# Altium schematic sheet Sheet1.SchDoc
size A
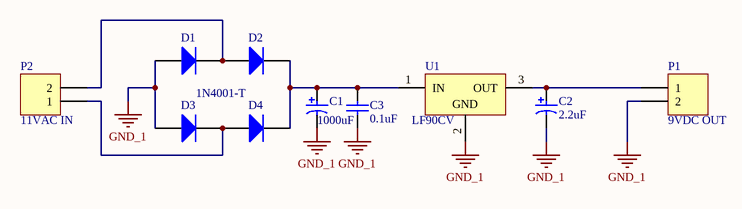
[diagram p0: Sheet1.SchDoc]

## Parts
C1  1000uF  [PNSC-EEUFM1H221-2]
C2  2.2uF  [CAPPR55-200-1100X500X1200]
C3  0.1uF  [VISH-K104K15X7RF5TL2]
D1  1N4001-T  [DIOD-DO-41-P-2_V]  (value not drawn)
D2  1N4001-T  [DIOD-DO-41-P-2_V]  (value not drawn)
D3  1N4001-T  [DIOD-DO-41-P-2_V]  (value not drawn)
D4  1N4001-T  [DIOD-DO-41-P-2_V]
P1  9VDC OUT  [MHDR1X2]
P2  11VAC IN  [MHDR1X2]
U1  LF90CV  [TO220]

## Nets
GND_1: C1.2 C2.2 C3.1 D1.1(A) D3.1(A) P1.2 U1.2(GND)
NetC1_1: C1.1 C3.2 D2.2(K) D4.2(K) U1.1(IN)
NetC2_1: C2.1 P1.1 U1.3(OUT)
NetD1_2: D1.2(K) D2.1(A) P2.2
NetD3_2: D3.2(K) D4.1(A) P2.1

## Library data of the parts
C1 = CMP-2000-05313-1: Aluminum Electrolytic Capacitor, 1000 uF, +/- 20%, 16 V, -40 to 105 degC, 2-Pin THD, RoHS, Tape and Reel; Manufacturer: Panasonic; Capacitance: 1000µF; Ripple Current: 1790mA; Rated Voltage: 16V; Impedance: 0.028O; Type: Radial; Lifetime@Temperature: 8000Hrs@105degC; Operating Temp-Max: 105degC; Operating Temp Range: -40to+105degC; Manufacturer URL: http://www.panasonic.com/; Datasheet URL: http://www.produktinfo.conrad.com/datenblaetter/425000-449999/446746-da-01-en-ALU_KONDENSATOR_FR_R_1000_UF_16V.pdf; Case Size/Dimension: Ø10x16mm; Datasheet Version: Nov-11; Series: FR
C2 = CMP-1665-00040-1: Aluminum Electrolytic Capacitor, 2.2 uF, +/- 20%, 50 V, -40 to 85 degC, 2-Pin THD, RoHS, Bulk; Min Supply Voltage: 1.71 V; Interface: I2C; Case\Package: QFN; Max Supply Voltage: 3.6 V; Load Capacitance: 400 pF; Nominal Supply Voltage: 2.5 V; RoHSCompliant: true; Length: 3 mm; Max Operating Temperature: 85 degC; ComponentLink2URL: http://industrial.panasonic.com/cdbs/www-data/pdf/RDF0000/DMF0000COL68.pdf; ComponentLink1Description: Manufacturer URL; Weight: 0.000617 oz; DatasheetVersion: Mar-16; Width: 3 mm; Packaging: Cut Tape; PackageDescription: 2-Pin Radial Lead, Dia 5 mm, Body Length 11 mm; REACH SVHC: No SVHC; Mount: Surface Mount; Min Operating Temperature: -40 degC; ComponentLink1URL: http://www.panasonic.com/; Height: 0.65 mm; PackageReference: CAPPR55-200-1100X500X1200; ComponentLink2Description: Datasheet; Radiation Hardening: No; Pins: 20; Package Quantity: 1
C3 = CMP-2000-06508-1: Ceramic Capacitor, 100 nF, +/- 10%, 50 V, -55 to 125 degC, 2-Pin THD, RoHS, Tape and Reel; Manufacturer: Vishay; Other Names: BC1084CT; Catalog Drawings: Mono-KapSide2-15_5.58Mono-KapSide1_15; Temperature Coefficient: X7R; Voltage - Rated: 50V; Online Catalog: Mono-Kap™Series; Capacitance: 0.1µF; Size / Dimension: 0.157"Lx0.098"W(4.00mmx2.50mm); Operating Temperature: -55°C~125°C; Family: CeramicCapacitors; Manufacturer URL: http://www.vishay.com/; Standard Package: 1; Thickness (Max): -; Ratings: -; Datasheet Version: 08/2013; Package Description: 2-Pin Through Hole Device, Body 4 x 2.6 mm; Mounting Type: ThroughHole; Features: -; Lead Spacing: 0.098"(2.50mm); Tolerance: ±10%; Category: Capacitors; Mounting Technology: ThroughHole; Lead Style: Straight; Datasheet URL: http://www.vishay.com/docs/45171/kseries.pdf; Applications: GeneralPurpose; Package / Case: Radial; Height - Seated (Max): 0.220"(5.58mm); Package Reference: K104K15X7RF5TL2; Series: Mono-Kap™K; Packaging: CutTape(CT)
D1-D4 = CMP-0639-00006-2: 1.0 A Rectifier, 15 pF, 50 V, -65 to 150 degC, 2-Pin DO-41 Plastic, RoHS, Tape and Reel; Manufacturer: Diodes Inc; VF (V): 1; CT (pF): 15; Max. IR (uA): 5; VRRM (V): 50; Max. IFSM (A): 30; RoHS: TRUE; Mounting Technology: Through Hole; PartNumber: 1N4001-T; ComponentLink2Description: Datasheet; DatasheetVersion: Rev. 8-2; Operating Temperature Range (degC): -65 to 150; Packing: Tape and Reel; PackageReference: DO-41-P-2; ComponentLink1URL: http://diodes.com/; PackageDescription: 2-Pin Axial Lead, Body 4.635 x 2.36 mm, Lead Spread 25.4 mm; ComponentLink2URL: http://diodes.com/datasheets/ds28002.pdf; Max. Average Rectified Current IO (A): 1; ComponentLink1Description: Manufacturer URL
P1 P2 = MHDR1X2: Header, 2-Pin; LatestRevisionDate: 17-Jul-2002; LatestRevisionNote: Re-released for DXP Platform.; Publisher: Altium Limited
U1 = CMP-0244-00445-1: 500mA, Very Low Drop (0.45V) Voltage Regulator, 9V, 3-Pin TO-220; ComponentLink3Description: Package Specification; ComponentLink2URL: http://www.st.com/internet/com/TECHNICAL_RESOURCES/TECHNICAL_LITERATURE/DATASHEET/CD00000546.pdf; ComponentLink1Description: Manufacturer URL; DatasheetVersion: 1/11/2010; ComponentLink3URL: http://www.st.com/internet/com/TECHNICAL_RESOURCES/TECHNICAL_LITERATURE/PACKAGE_INFORMATION/CD00004649.pdf; PackageDescription: TO, Thru-Hole, Vertical, Heatsink Mounted; 3 In-Line Leads; Pitch 2.54 mm; ComponentLink2Description: Datasheet; PackageReference: TO220; PackageVersion: ver3.0; ComponentLink1URL: http://www.st.com